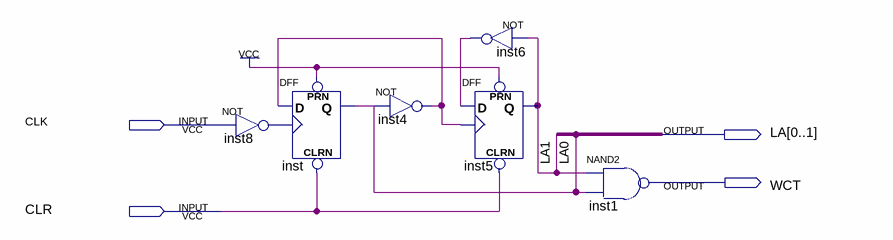
[diagram p0: schematic sheet]
// Quartus schematic Counter_quanternary.bdf as structural Verilog: 6 symbols, 4 pins
module Counter_quanternary (
  input  CLK,
  input  CLR,
  output [0:1] LA,
  output WCT
);

  wire inst4_out, inst6_out, inst8_out;

  not inst8 (inst8_out, CLK);
  DFF inst (.CLRN(CLR), .CLK(inst8_out), .D(inst4_out), .PRN(1'b1), .Q(LA[0]));
  not inst4 (inst4_out, LA[0]);
  not inst6 (inst6_out, LA[1]);
  DFF inst5 (.CLRN(CLR), .CLK(inst4_out), .D(inst6_out), .PRN(1'b1), .Q(LA[1]));
  nand inst1 (WCT, LA[1], LA[0]);
endmodule
